# Altium schematic sheet ADC.SchDoc
size A4; SheetNumber: 5; SheetTotal: 11
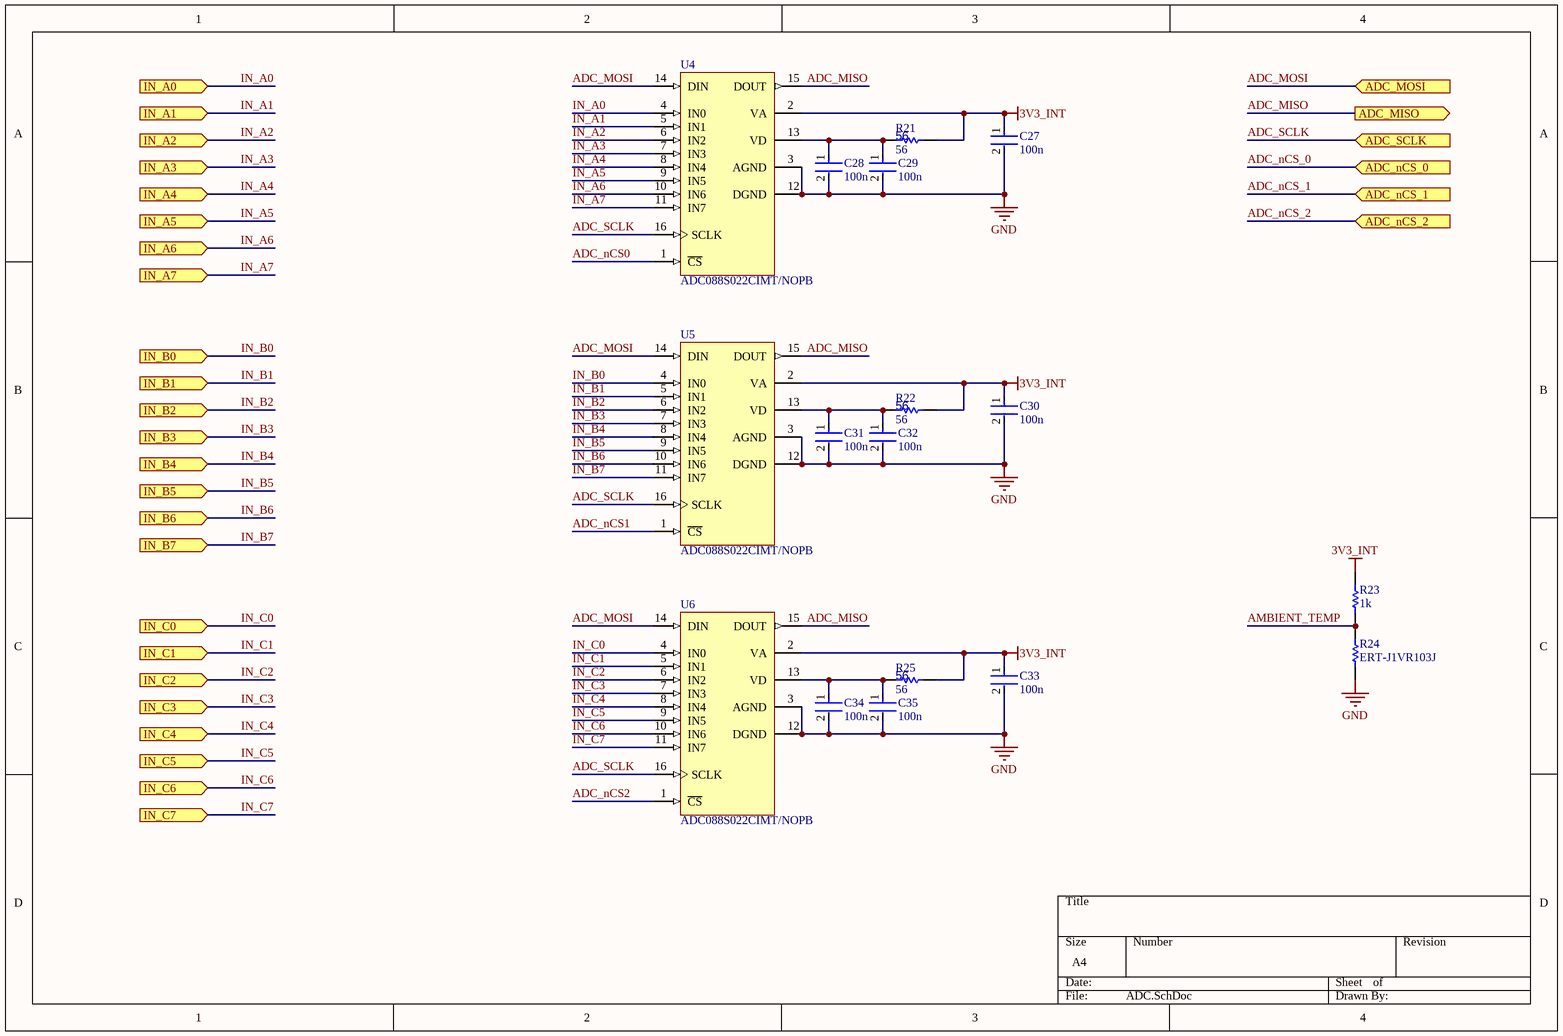
[diagram p0: ADC.SchDoc]

## Parts
C27  100n  [FP-0402-L_1_0_0_05-W_0_5-IPC_A]
C28  100n  [FP-0402-L_1_0_0_05-W_0_5-IPC_A]
C29  100n  [FP-0402-L_1_0_0_05-W_0_5-IPC_A]
C30  100n  [FP-0402-L_1_0_0_05-W_0_5-IPC_A]
C31  100n  [FP-0402-L_1_0_0_05-W_0_5-IPC_A]
C32  100n  [FP-0402-L_1_0_0_05-W_0_5-IPC_A]
C33  100n  [FP-0402-L_1_0_0_05-W_0_5-IPC_A]
C34  100n  [FP-0402-L_1_0_0_05-W_0_5-IPC_A]
C35  100n  [FP-0402-L_1_0_0_05-W_0_5-IPC_A]
R21  56  [R0603B]
R22  56  [R0603B]
R23  1k  [R0603B]
R24  ERT-J1VR103J  [RESC1608X90X30ML15T20]
R25  56  [R0603B]
U4  ADC088S022CIMT/NOPB  [MTC16_L]
U5  ADC088S022CIMT/NOPB  [MTC16_L]
U6  ADC088S022CIMT/NOPB  [MTC16_L]

## Ports
ADC_MISO (out, see CHILD_BOARD[5A]), ADC_MOSI (in, see CHILD_BOARD[5A]), ADC_nCS_0 (in), ADC_nCS_1 (in, see CHILD_BOARD[5A]), ADC_nCS_2 (in, see CHILD_BOARD[5A]), ADC_SCLK (in, see CHILD_BOARD[5A]), IN_A0 (in), IN_A1 (in), IN_A2 (in), IN_A3 (in), IN_A4 (in), IN_A5 (in), IN_A6 (in), IN_A7 (in), IN_B0 (in), IN_B1 (in), IN_B2 (in), IN_B3 (in), IN_B4 (in), IN_B5 (in), IN_B6 (in), IN_B7 (in), IN_C0 (in), IN_C1 (in), IN_C2 (in), IN_C3 (in), IN_C4 (in), IN_C5 (in), IN_C6 (in), IN_C7 (in)

## Nets
3V3_INT: C27.1 C30.1 C33.1 R21.1 R22.1 R23.2 R25.1 U4.2(VA) U5.2(VA) U6.2(VA)
GND: C27.2 C28.2 C29.2 C30.2 C31.2 C32.2 C33.2 C34.2 C35.2 R24.1 U4.3(AGND) U4.12(DGND) U5.3(AGND) U5.12(DGND) U6.3(AGND) U6.12(DGND)
ADC_MISO: U4.15(DOUT) U5.15(DOUT) U6.15(DOUT) ; port ADC_MISO
ADC_MOSI: U4.14(DIN) U5.14(DIN) U6.14(DIN) ; port ADC_MOSI
ADC_nCS0: U4.1(~{CS})
ADC_nCS1: U5.1(~{CS})
ADC_nCS2: U6.1(~{CS})
ADC_nCS_0: port ADC_nCS_0
ADC_nCS_1: port ADC_nCS_1
ADC_nCS_2: port ADC_nCS_2
ADC_SCLK: U4.16(SCLK) U5.16(SCLK) U6.16(SCLK) ; port ADC_SCLK
AMBIENT_TEMP: R23.1 R24.2
IN_A0: U4.4(IN0) ; port IN_A0
IN_A1: U4.5(IN1) ; port IN_A1
IN_A2: U4.6(IN2) ; port IN_A2
IN_A3: U4.7(IN3) ; port IN_A3
IN_A4: U4.8(IN4) ; port IN_A4
IN_A5: U4.9(IN5) ; port IN_A5
IN_A6: U4.10(IN6) ; port IN_A6
IN_A7: U4.11(IN7) ; port IN_A7
IN_B0: U5.4(IN0) ; port IN_B0
IN_B1: U5.5(IN1) ; port IN_B1
IN_B2: U5.6(IN2) ; port IN_B2
IN_B3: U5.7(IN3) ; port IN_B3
IN_B4: U5.8(IN4) ; port IN_B4
IN_B5: U5.9(IN5) ; port IN_B5
IN_B6: U5.10(IN6) ; port IN_B6
IN_B7: U5.11(IN7) ; port IN_B7
IN_C0: U6.4(IN0) ; port IN_C0
IN_C1: U6.5(IN1) ; port IN_C1
IN_C2: U6.6(IN2) ; port IN_C2
IN_C3: U6.7(IN3) ; port IN_C3
IN_C4: U6.8(IN4) ; port IN_C4
IN_C5: U6.9(IN5) ; port IN_C5
IN_C6: U6.10(IN6) ; port IN_C6
IN_C7: U6.11(IN7) ; port IN_C7
NetC28_1: C28.1 C29.1 R21.2 U4.13(VD)
NetC31_1: C31.1 C32.1 R22.2 U5.13(VD)
NetC34_1: C34.1 C35.1 R25.2 U6.13(VD)

## Library data of the parts
C27-C35 = CMP-001-00058-1: LARGE PADS, 0402 CAP, CHANGE COMMENT TO MATCH REAL P/N; Capacitor Type: Ceramic; Min Operating Temperature: -55°C; Mounting Technology: Surface Mount; Pins: 2; Case/Package: 0402; RoHS Compliant: Yes; Max Operating Temperature: 85°C
R21-R23 R25 = CMP-009-00002-14: Resistor
  R21 R22 R25: Value: 56
  R23: Value: 1k
R24 = CMP-2000-00869-1: Manufacturer: Panasonic; Part Number: ERT-J1VR103J
U4-U6 = CMP-0054-00372-2: 8-Channel, 50 kSPS to 200 kSPS, 8-Bit A/D Converter, 16-pin TSSOP, Pb-Free; Manufacturer: National Semiconductor; PackageTopMarking: NSUZXYTT*88S022*CIMT; CompType: ADC IC; PowerWise: Y; ComponentLink2URL: http://www.national.com/pf/AD/ADC088S022.html; RoHS: Y; PackageDescription: Molded TSSOP, Jedec, 5 x 4.4 x 0.9mm Body, 16 Lead, 0.65mm Pitch; DatasheetVersion: Feb-2010; PinCount: 16; ComponentLink1Description: ADC088S022 Datasheet; Code_JEDEC: MO-153-AB; ComponentLink3URL: http://www.national.com/packaging/folders/mtc16.html; PackageVersion: revD, Jun-2003; ComponentLink3Description: MTC16 Package Page; RevisionNote: Component URLs added; ComponentLink1URL: http://www.national.com/ds/AD/ADC088S022.pdf; ComponentLink2Description: ADC088S022 Web Page; PackageReference: MTC16